# EAGLE design PIC24fj64GAB002 (EAGLE 5.11)
LEFT: DCIN; LICENSE: CC-0; PROJECT: PIC24FJ64GB002; RIGHT: USB
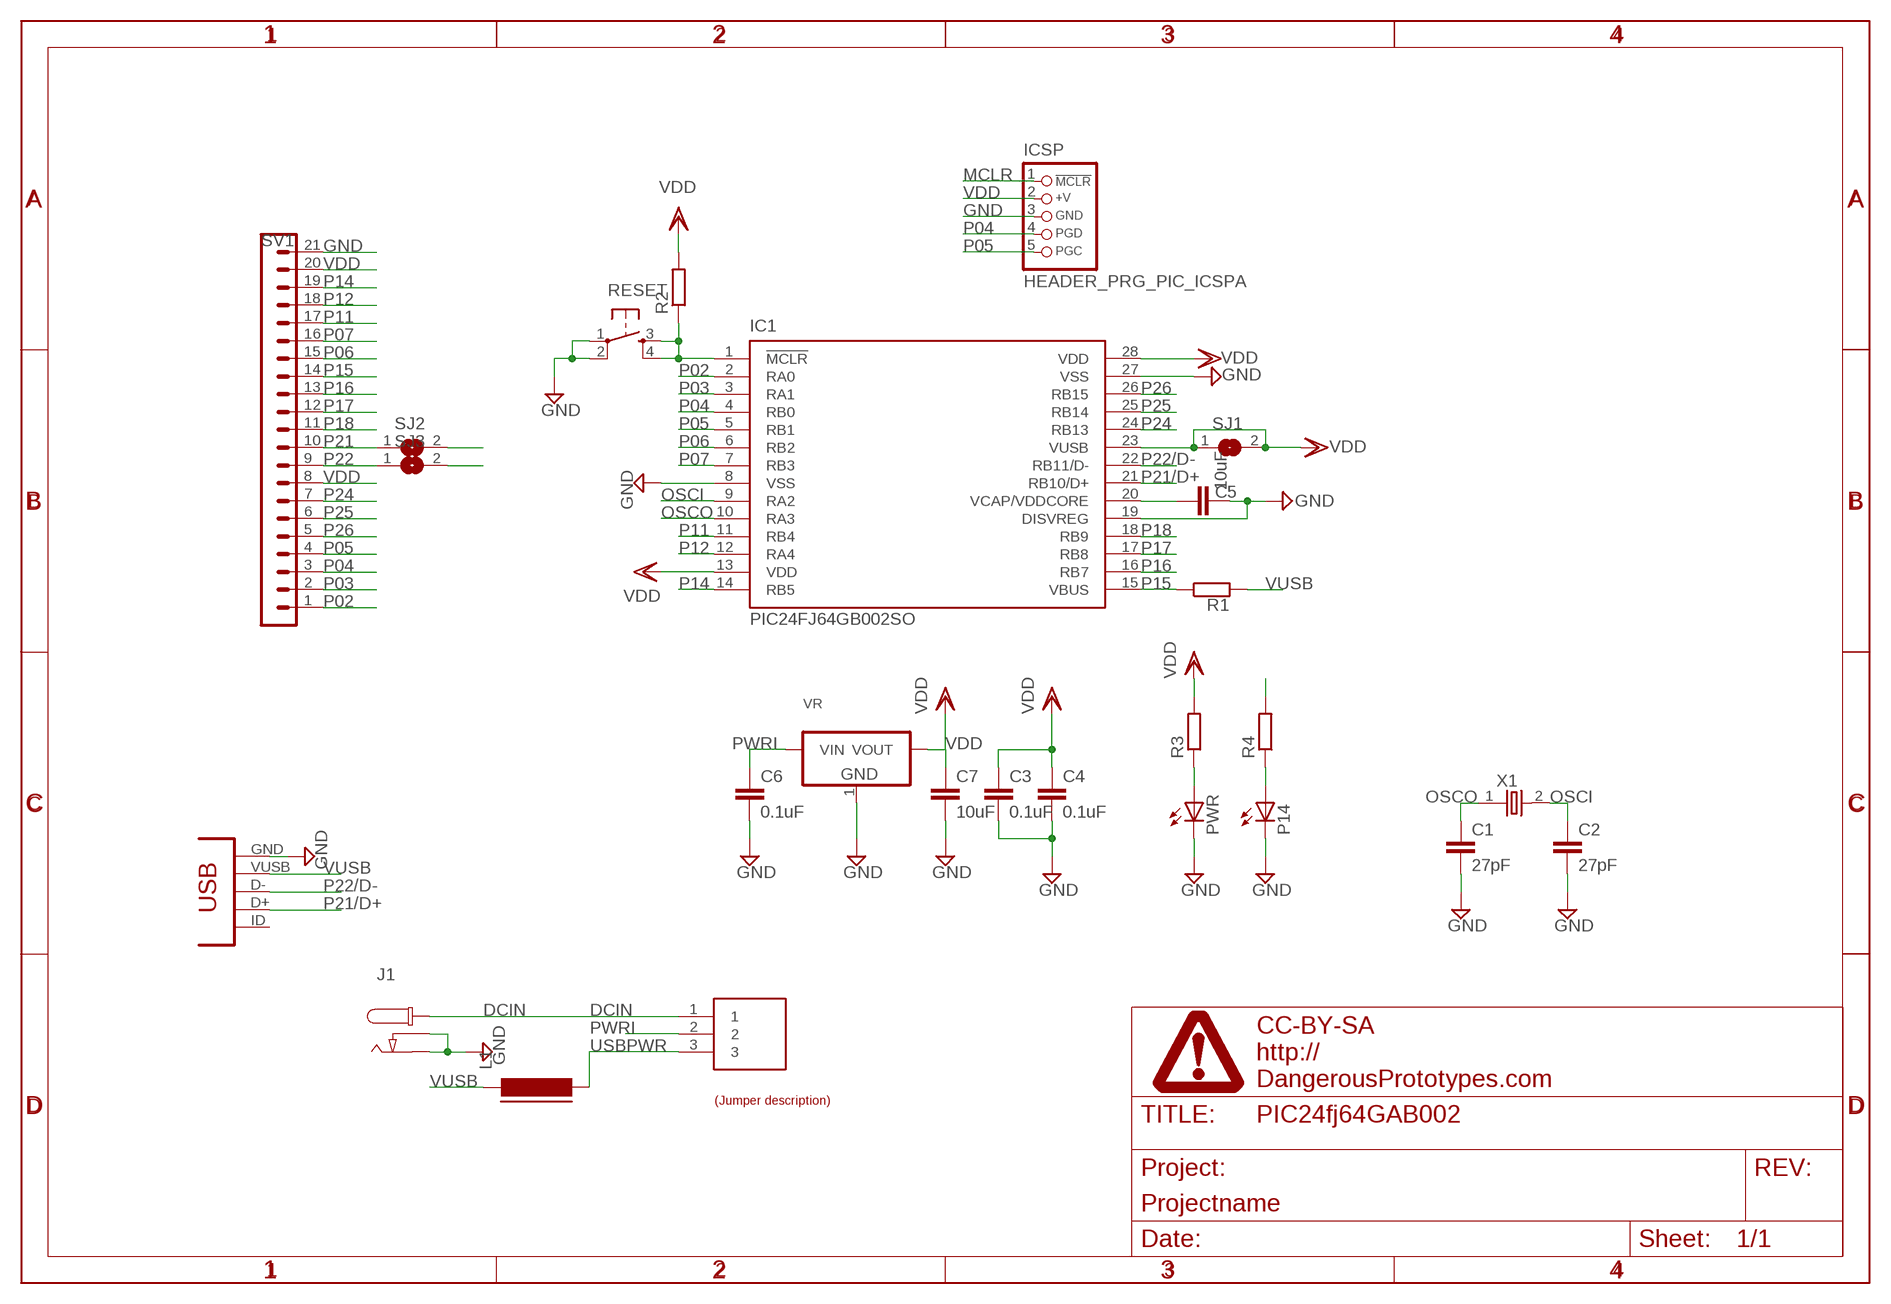
[diagram p0: schematic, sheet 1]

## Parts
C1  27pF  CAPC603  [C603]
C2  27pF  CAPC603  [C603]
C3  0.1uF  CAPC603  [C603]
C4  0.1uF  CAPC603  [C603]
C5  10uF  CAPC603  [C603]
C6  0.1uF  CAPC603  [C603]
C7  10uF  CAPC603  [C603]
IC1  PIC24FJ64GB002SO  [SOIC28W]
ICSP  HEADER_PRG_PIC_ICSPA  [HEADER_PRG_1X05]
J1  DC_BARREL_JACK-SMD  [DC_BARREL_JACK_SMD_2MM]
L1  FERRITE_BEAD603  [FB603]
P14  LED805  [LED-805]
PWR  LED805  [LED-805]
R1  RESISTORR603  [R603]
R2  RESISTORR603  [R603]
R3  RESISTORR603  [R603]
R4  RESISTORR603  [R603]
RESET  SW-SMD-SMALL  [TACT_SWITCH_SMALL]
SJ1  SJ  [SJ]
SJ2  SJ  [SJ]
SJ3  SJ  [SJ]
SV1  MA20-1  [MA20-1]
U$1  DINA4_L  [DP_LOGO]
U$3  HEADER1X3PTH  [M1X3]
U$4  JUMP3_DESC  [JUMP3_DESC]
USB1  CON-USB-MINI-BUSB1  [CONN_USB_MINI-B]
VR  LD1117-3.3SOT223  [SOT223]
X1  OSC-XTAL  [HC-49U]

## Nets
DCIN: J1.P1@2(P1) U$3.1
GND: C1.2 C2.2 C3.2 C4.2 C5.2 C6.2 C7.2 IC1.8(VSS) IC1.19(DISVREG) IC1.27(VSS) ICSP.3(GND) J1.P2 J1.P3 P14.C PWR.C RESET.1 RESET.2 SV1.21 USB1.GND VR.1(GND)
MCLR: IC1.1(!MCLR) ICSP.1(/MCLR) R2.1 RESET.3 RESET.4
N$1: P14.A R4.1
N$2: PWR.A R3.1
N$4: C5.1 IC1.20(VCAP/VDDCORE)
OSCI: C2.1 IC1.9(RA2) X1.2
OSCO: C1.1 IC1.10(RA3) X1.1
P02: IC1.2(RA0) SV1.1
P03: IC1.3(RA1) SV1.2
P04: IC1.4(RB0) ICSP.4(PGD) SV1.3
P05: IC1.5(RB1) ICSP.5(PGC) SV1.4
P06: IC1.6(RB2) SV1.15
P07: IC1.7(RB3) SV1.16
P11: IC1.11(RB4) SV1.17
P12: IC1.12(RA4) SV1.18
P14: IC1.14(RB5) R4.2 SV1.19
P15: IC1.15(VBUS) R1.1 SV1.14
P16: IC1.16(RB7) SV1.13
P17: IC1.17(RB8) SV1.12
P18: IC1.18(RB9) SV1.11
P21: SJ2.1 SV1.10
P21/D+: IC1.21(RB10/D+) SJ2.2 USB1.D+
P22: SJ3.1 SV1.9
P22/D-: IC1.22(RB11/D-) SJ3.2 USB1.D-
P24: IC1.24(RB13) SV1.7
P25: IC1.25(RB14) SV1.6
P26: IC1.26(RB15) SV1.5
PWRI: C6.1 U$3.2 VR.3(VIN)
USBPWR: L1.2 U$3.3
VDD: C3.1 C4.1 C7.1 IC1.13(VDD) IC1.23(VUSB) IC1.28(VDD) ICSP.2(+V) R2.2 R3.2 SJ1.1 SJ1.2 SV1.8 SV1.20 VR.2(VOUT)
VUSB: L1.1 R1.2 USB1.VUSB
Unconnected: USB1.BODY@1(BODY) USB1.BODY@2(BODY) USB1.BODY@3(BODY) USB1.BODY@4(BODY) USB1.ID(USBID)

## Library data of the parts
C1-C7 = dp_devices:CAP
IC1 = dp_devices:PIC24FJ64GB002: PIC24FJ64GA002 edit this description Auto generated by make-symbol-device-package-bsdl.ulp Rev. 25 Source: PIC24FJ64GA002.bsd
ICSP = dp_devices:HEADER_PRG_PIC_ICSP: 5-pin PIC In Circuit Serial Programming header
J1 = dp_devices:DC_BARREL_JACK: DC power connector
L1 = dp_devices:FERRITE_BEAD
P14 PWR = dp_devices:LED
R1-R4 = dp_devices:RESISTOR
RESET = dp_devices:SW-SMD-SMALL
SJ1-SJ3 = jumper:SJ: SMD solder JUMPER
SV1 = con-lstb:MA20-1: PIN HEADER; OC_FARNELL: unknown; OC_NEWARK: unknown
U$1 = dp_devices:DINA4_L: A4 DP frame Standard Dangerous Prototypes schematic frame. Automagically adds the DP logo and standard texts to the PCB Use the atrribute in the schematic editor to change the fields.; FF1: fulfillment by; FF2: Seeed Studio; FF3: www.seeedstudio.com; LICENSE: CC-BY-SA; PROJECT: Projectname; URL1: http://; URL2: DangerousPrototypes.com
U$3 = dp_devices:HEADER1X3
U$4 = dp_devices:JUMP3_DESC: Nice formatted three legged jumperdescription Use attributes to change the values LEFT = With jumper to the left RIGHT = With jumper to the right; LEFT: left; RIGHT: right
USB1 = dp_devices:CON-USB-MINI-B: USB connector
VR = dp_devices:LD1117-3.3
X1 = dp_devices:OSC-XTAL

## Board
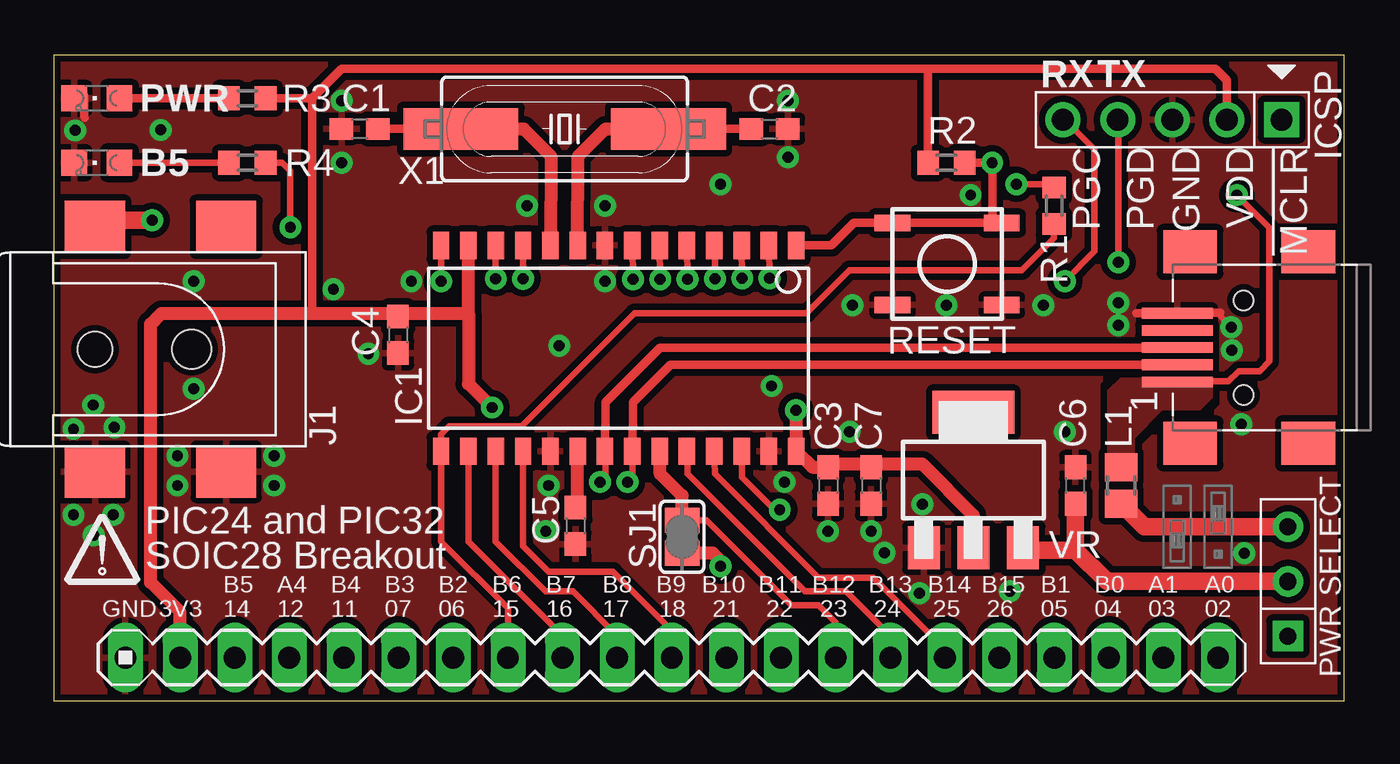
[diagram p1: board, top side]
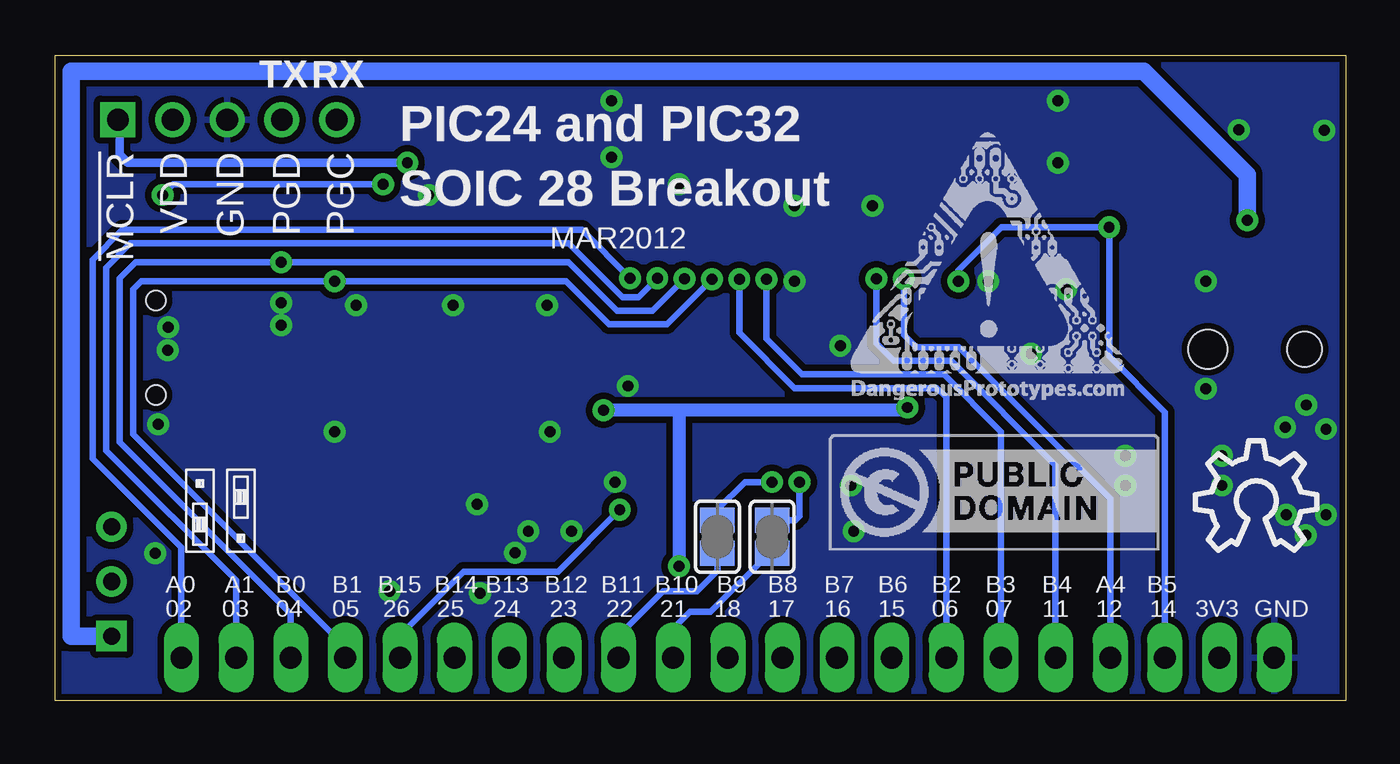
[diagram p2: board, bottom side, seen from below]

Size 60 x 30 mm. Coordinates in mm from the lower left corner, seen from the top.
Outline: 60,30 0,30 0,0 60,0 60,30
Copper layers (1*16): Top 0.035mm / dielectric 1.5mm / Bottom 0.035mm
Design rules "SparkFun": minimum track width 8mil, minimum drill 20mil, track to track 8mil, track to pad 8mil, pad to pad 8mil, via to via 8mil, smd to smd 8mil, copper to edge 10mil, drill to drill 8mil, minimum pad ring 12mil, minimum via ring 10mil, stop-mask expansion 4mil, vias tented up to drill 25mil, thermal gap 10mil

### Footprints (pad centres in the part's own frame; a part is rotated, then mirrored left to right if it is on the bottom)
C603 = smd 1.1 x 1: 1 -0.85,0; 2 0.85,0
SOIC28W = smd 0.762 x 1.27: 1 -8.89,-4.78; 2 -7.62,-4.78; 3 -6.35,-4.78; 4 -5.08,-4.78; 5 -3.81,-4.78; 6 -2.54,-4.78; 7 -1.27,-4.78; 8 0,-4.78; 9 1.27,-4.78; 10 2.54,-4.78; 11 3.81,-4.78; 12 5.08,-4.78; 13 6.35,-4.78; 14 7.62,-4.78; 15 7.62,4.78; 16 6.35,4.78; 17 5.08,4.78; 18 3.81,4.78; 19 2.54,4.78; 20 1.27,4.78; 21 0,4.78; 22 -1.27,4.78; 23 -2.54,4.78; 24 -3.81,4.78; 25 -5.08,4.78; 26 -6.35,4.78; 27 -7.62,4.78; 28 -8.89,4.78
HEADER_PRG_1X05 = drill 1.016 square: 1 -5.08,0 | drill 1.016 round: 2 -2.54,0; 3 0,0; 4 2.54,0; 5 5.08,0
DC_BARREL_JACK_SMD_2MM = smd 2.4 x 2.8: P1@1 -5.7,3.875; P1@2 -5.7,-2.225; P2 5.7,-2.225; P3 5.7,3.875 | hole 1.8: 0,2.275 | hole 1.6: 0,-2.225
FB603 = smd 1.3 x 1.5: 1 -0.85,0; 2 0.85,0
LED-805 = smd 1.2 x 1.2: A 0,-1.05; C 0,1.05
R603 = smd 1 x 1.1: 1 -0.85,0; 2 0.85,0
TACT_SWITCH_SMALL = smd 1.651 x 0.762: 1 -2.54,1.905; 2 2.54,1.905; 3 -2.54,-1.905; 4 2.54,-1.905
SJ = smd 1.168 x 1.6: 1 -0.762,0; 2 0.762,0
MA20-1 = drill 1.016 long: 1 -24.13,0; 2 -21.59,0; 3 -19.05,0; 4 -16.51,0; 5 -13.97,0; 6 -11.43,0; 7 -8.89,0; 8 -6.35,0; 9 -3.81,0; 10 -1.27,0; 11 1.27,0; 12 3.81,0; 13 6.35,0; 14 8.89,0; 15 11.43,0; 16 13.97,0; 17 16.51,0; 18 19.05,0; 19 21.59,0; 20 24.13,0; 21 26.67,0
M1X3 = drill 0.8 square: 1 0,0 | drill 0.8 round: 2 2.54,0; 3 5.08,0
CONN_USB_MINI-B = smd 2 x 2.5: BODY@1 -4.45,2.5; BODY@2 4.45,2.5; BODY@3 4.45,-3; BODY@4 -4.45,-3 | smd 0.5 x 3.3: D+ 0,3.1; D- -0.8,3.1; GND 1.6,3.1; ID 0.8,3.1; VUSB -1.6,3.1 | hole 0.9: -2.2,0; 2.2,0
SOT223 = smd 1.5 x 2: 1 -2.3,-3.15; 2 0,-3.15; 3 2.3,-3.15 | smd 3.8 x 2: 4 0,3.15
HC-49U = smd 5.334 x 1.93: 1 -4.826,0; 2 4.826,0

### Placement (x,y rotation side)
C1  [C603]  14.22,26.57 180 top
C2  [C603]  33.27,26.57 0 top
C3  [C603]  36,10 270 top
C4  [C603]  16,17 270 top
C5  [C603]  24.25,8.12 270 top
C6  [C603]  47.5,10 90 top
C7  [C603]  38,10 270 top
IC1  25.62,16.38 180 top
ICSP  52,27 180 top
J1  4.14,16.33 270 top
L1  49.62,10 270 top
P14  2,25 90 top
PWR  2,28 90 top
R1  46.5,23 90 top
R2  41.5,25 180 top
R3  9,28 0 top
R4  9,25 0 top
RESET  41.53,20.29 180 top
SJ1  29.21,7.62 270 top
SJ2  26.67,7.62 90 bottom
SJ3  29.21,7.62 90 bottom
SV1  30,2 180 top
U$1  2.25,6.02 0 top
U$2  [DP_LOGO_ART_0.5X0.5]  23,14 0 bottom
U$3  57.38,3 90 top
U$4  JUMP3_DESC  [JUMP3_DESC@1]  52,12 90 bottom
U$5  [LOGO_CC-0]  24,7 0 bottom
U$6  LABEL_JUMPER_1X3  [JUMP3_DESC]  53.5,11.25 90 top
U$7  [OSHW_10X200_NOTEXT]  7,7 0 bottom
USB1  55.32,16.41 90 top
VR  42.75,10.25 0 top
X1  23.75,26.57 0 top

### Tracks (layer width: path | path; a pad name or v marks a point on that pad's centre or on a via)
DCIN  (via drill 0.51)
  Top 0.813: J1.P1@2 2.06,22.33 v4.57,22.33
  Bottom 0.813: v4.57,22.33 4.57,24.43 9.39,29.25 59.25,29.25 59.25,3 U$3.1
GND  (via drill 0.51)
  Top 0.254: 54.23,18.03 54.23,17.86 v54.74,17.35
  Top 0.406: 50.75,18.01 50.32,18.01 | 54.23,18.03 53.75,18.03 | 1.45,27.1 1.42,27.13 1.42,28.11 PWR.C
  other vias: 54.77,16.28 49.49,17.45 37.12,18.38 23,10 42.62,23.5 34.12,25.25 34.12,27.88 13.38,25 44.45,5.08 55.35,6.86 25.62,19.5 23.5,16.5 47,12.5 55.2,12.84 16.62,19.5 13,19.12 14.62,16.12 37,12.5 36,7.88 33.97,10.16 40.25,5 40.38,9.12 31,24 25.62,23 6.5,19.5 6.5,14.5 10.25,10 49.5,18.5 13.38,27.88 22,23 1,26.5 4.98,26.52 22.88,7.88 1.83,13.74 2.82,12.7 0.91,12.62 0.91,8.64 2.77,8.64 1.85,7.7 38,7.88 46,18.38 41.5,18.38 5.75,11.38 5.75,10 10.25,11.38 38.62,6.88 33.38,14.62
  pour Top (isolate 0.305, rank 6): 60,30 0,30 0,0 60,0
  pour Bottom (isolate 0.305, rank 6): 60,30 0,30 0,0 60,0
MCLR  (via drill 0.51)
  Top 0.406: IC1.1 36.16,21.16 37.2,22.2 RESET.4 RESET.3 43.62,22.27 v43.62,25 R2.1
  Bottom 0.406: ICSP.1 57,27 57,25.38 56.62,25 v43.62,25
N$1
  Top 0.305: P14.A R4.1
N$2
  Top 0.406: PWR.A R3.1
N$4
  Top 0.61: IC1.20 24.36,9.08 C5.1
OSCI
  Top 0.406: 29.46,26.57 C2.1
  Top 0.61: IC1.9 24.38,25.3 25.65,26.57 X1.2 29.46,26.57
OSCO
  Top 0.406: C1.1 X1.1
  Top 0.61: IC1.10 23.11,25.3 21.84,26.57 X1.1
P02  (via drill 0.51)
  Top 0.305: v33.27,19.63 IC1.2
  Bottom 0.305: SV1.1 54.13,7.13 58.25,11.25 58.25,20.5 56.88,21.88 35.52,21.88 v33.27,19.63
P03  (via drill 0.51)
  Top 0.305: v32,19.63 IC1.3 32,21.49
  Bottom 0.305: SV1.2 51.59,5.59 57.62,11.62 57.62,20.12 56.5,21.25 36.12,21.25 33.62,18.75 32.89,18.75 v32,19.63
P04  (via drill 0.51)
  Top 0.305: v30.73,19.61 30.73,20.65 | ICSP.4 49.5,27 v49.5,20.38
  Top 0.406: 30.73,20.65 IC1.4
  Bottom 0.305: SV1.3 49.05,4.05 57,12 57,19.62 56.25,20.38 v49.5,20.38 36.12,20.38 33.88,18.12 32.22,18.12 v30.73,19.61
P05  (via drill 0.51)
  Top 0.305: v29.46,19.58 IC1.5 | ICSP.5 47,27 48.38,25.62 48.38,20.88 v47,19.5
  Bottom 0.305: SV1.4 46.51,2.51 56.38,12.38 56.38,19.12 56,19.5 v47,19.5 36.25,19.5 34.25,17.5 31.55,17.5 v29.46,19.58
P06  (via drill 0.51)
  Top 0.305: v28.19,19.58 IC1.6
  Bottom 0.305: SV1.15 18.57,14.1 19,14.53 25.62,14.53 28.19,17.1 v28.19,19.58
P07  (via drill 0.51)
  Top 0.305: v26.92,19.58 IC1.7
  Bottom 0.305: v26.92,19.58 26.92,16.82 25.27,15.16 18.69,15.16 16.03,12.5 SV1.16
P11  (via drill 0.51)
  Top 0.305: IC1.11 v21.82,19.61
  Bottom 0.305: v21.82,19.61 21.82,16.61 21.01,15.79 18.34,15.79 13.49,10.95 SV1.17
P12  (via drill 0.51)
  Top 0.305: IC1.12 v20.55,19.61
  Bottom 0.305: v20.55,19.61 20.55,17.01 19.96,16.43 17.98,16.43 10.95,9.39 SV1.18
P14  (via drill 0.51)
  Top 0.305: R4.2 10.62,25 11,24.62 v11,22 | v18,19.5 18,21
  Top 0.406: IC1.14 18,21
  Bottom 0.305: SV1.19 8.41,13.41 11,16 v11,22 16,22 18,20 v18,19.5
P15
  Top 0.305: SV1.14 21.11,4.29 18,7.39 IC1.15 18,12.38 18.38,12.75 21.75,12.75 27,18 35,18 37,20 45,20 46.5,21.5 R1.1
P16
  Top 0.305: SV1.13 23.65,3.02 19.27,7.39 IC1.16
P17
  Top 0.305: SV1.12 26.19,3.02 24.13,5.08 22.86,5.08 20.55,7.39 IC1.17
P18
  Top 0.305: SV1.11 28.73,3.27 26,6 23,6 21.82,7.18 IC1.18
P21
  Bottom 0.305: SV1.10 31.27,3.34 30.48,4.13 29.53,4.13 26.8,6.86 SJ2.1
P21/D+  (via drill 0.51)
  Top 0.305: IC1.21 25.65,10.41 v25.4,10.16
  Top 0.406: USB1.D+ 28.19,16.41 25.65,13.87 IC1.21
  Bottom 0.305: SJ2.2 25.59,8.38 25.4,8.57 v25.4,10.16
P22
  Bottom 0.305: SJ3.1 29.21,6.03 30.16,5.08 31.75,5.08 33.81,3.02 SV1.9
P22/D-  (via drill 0.51)
  Top 0.305: IC1.22 26.92,11.63 26.9,11.61 26.9,10.39 v26.67,10.16
  Top 0.406: USB1.D- 28.66,15.61 26.92,13.87 IC1.22
  Bottom 0.305: v26.67,10.16 27.94,10.16 29.21,8.89 SJ3.2
P24
  Top 0.305: 29.46,11.63 IC1.24 29.46,10.54 34.92,5.08 36.83,5.08 38.89,3.02 SV1.7
P25
  Top 0.305: 30.73,11.66 IC1.25 30.73,10.54 35.56,5.71 38.1,5.71 41.43,2.38 SV1.6
P26  (via drill 0.51)
  Top 0.305: 32,11.18 IC1.26 32,11.57 32,10.38 33.5,8.88 v33.75,8.88
  Bottom 0.305: SV1.5 43.97,3.03 41,6 36.62,6 v33.75,8.88
PWRI
  Top 0.813: VR.3 45.3,6.92 45.38,7 47.5,7 | 47.5,7 C6.1 | U$3.2 48.96,5.54 47.5,7
USBPWR
  Top 0.813: U$3.3 50.7,8.08 L1.2
VDD  (via drill 0.51)
  Top 0.305: SV1.8 36.35,3.65 35.56,4.45 34.29,4.45 30.35,8.38 SJ1.1
  Top 0.406: 29.46,7.16 SJ1.2 SJ1.1 | IC1.13 | IC1.23 28.17,11.63 | ICSP.2 54.54,28.84 54,29.38 40.62,29.38 | R2.2 40.65,29.35 40.62,29.38 | 12,28 R3.2 | 40.62,29.38 13.38,29.38 12,28 | 12,18 12,28
  Top 0.61: IC1.23 28.19,10.54 29.21,9.53 SJ1.1 | 34.5,11.62 34.57,11.69 | v34.5,13.5 34.5,11.62 | 34.5,11.62 34.5,11.61 IC1.28 35.26,10.85 C3.1 36,11 37.85,11 C7.1 38,11 40.38,11 42.75,8.62 VR.2 | SJ1.2 30.64,6.86 31,6.5 v31,6.25 | 19.28,18 19.28,14.72 v20.38,13.62 | 19.28,18 IC1.13 | SV1.20 5.87,4.13 4.5,5.5 4.5,17.5 5,18 12,18 16,18 | 16,18 19.28,18 | 16,18 C4.1
  Bottom 0.61: 31,13.5 v34.5,13.5 | 31,13.5 v31,6.25 | v20.38,13.62 20.5,13.5 31,13.5
VUSB  (via drill 0.51)
  Top 0.254: USB1.VUSB 51.64,14.81 | USB1.VUSB
  Top 0.305: 51.64,14.81 51.13,14.81 51.11,14.83 54.61,14.83 55.09,15.32 56.06,15.32 56.52,15.77 56.52,21.98 v55,23.5 | R1.2 46,24 v44.75,24
  Bottom 0.305: v44.75,24 54.5,24 v55,23.5
  pour Top (no thermals): 49.12,11 49.12,14.38 49.62,14.88 53.75,14.88 53.75,14.12 53.25,13.62 51.5,13.62 50.12,12.25 50.12,11

### Text on the board
tNames: RX | TX | PGC | PGD | GND | VDD | !MCLR | B5 | PIC24 and PIC32 | SOIC28 Breakout | B5 | A4 | B4 | B3 | B2 | B6 | B7 | B8 | B9 | B10 | B11 | B12 | B13 | B14 | B15 | B1 | B0 | A1 | A0 | GND | 3V3 | 14 | 12 | 11 | 07 | 06 | 15 | 16 | 17 | 18 | 21 | 22 | 23 | 24 | 25 | 26 | 05 | 04 | 03 | 02 | PWR SELECT
bNames: RX | TX | PIC24 and PIC32 | PGC | PGD | GND | VDD | !MCLR | SOIC 28 Breakout | MAR2012 | B5 | A4 | B4 | B3 | B2 | B6 | B7 | B8 | B9 | B10 | B11 | B12 | B13 | B14 | B15 | B1 | B0 | A1 | A0 | GND | 3V3 | 14 | 12 | 11 | 07 | 06 | 15 | 16 | 17 | 18 | 21 | 22 | 23 | 24 | 25 | 26 | 05 | 04 | 03 | 02